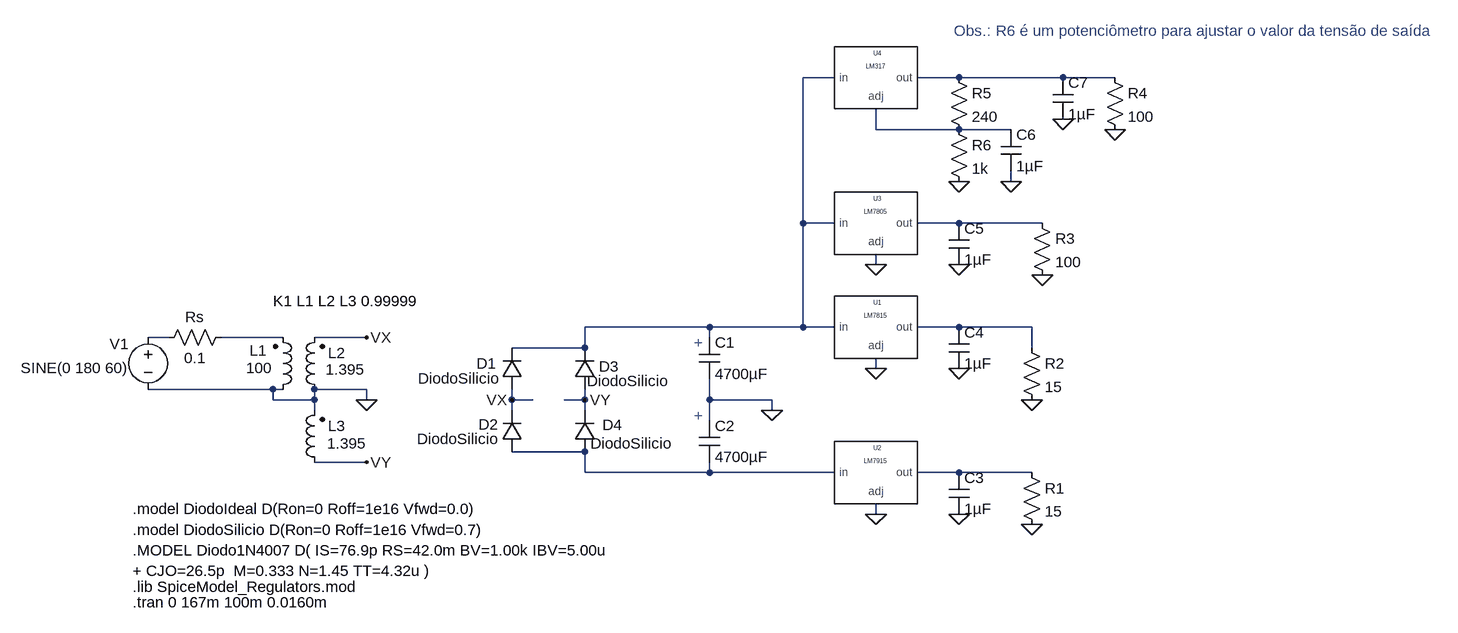
[diagram p0: schematic FonteLinear.Simula.LTSpice.asc]
FonteLinear.Simula.LTSpice.asc, the LTspice schematic file:
Version 4
SHEET 1 2300 1300
WIRE 1008 -16 960 -16
WIRE 1200 -16 1136 -16
WIRE 1360 -16 1200 -16
WIRE 1440 -16 1360 -16
WIRE 1072 64 1072 32
WIRE 1200 64 1072 64
WIRE 1280 64 1200 64
WIRE 1280 144 1280 128
WIRE 960 208 960 -16
WIRE 1008 208 960 208
WIRE 1200 208 1136 208
WIRE 1328 208 1200 208
WIRE 1072 272 1072 256
WIRE 816 368 624 368
WIRE 960 368 960 208
WIRE 960 368 816 368
WIRE 1008 368 960 368
WIRE 1200 368 1136 368
WIRE 1312 368 1200 368
WIRE -16 384 -48 384
WIRE 160 384 64 384
WIRE 288 384 208 384
WIRE 816 384 816 368
WIRE 624 400 624 368
WIRE 624 400 512 400
WIRE 1312 400 1312 368
WIRE 1072 432 1072 416
WIRE 144 464 -48 464
WIRE 160 464 144 464
WIRE 288 464 208 464
WIRE 144 480 144 464
WIRE 208 480 208 464
WIRE 208 480 144 480
WIRE 288 480 288 464
WIRE 512 480 512 464
WIRE 544 480 512 480
WIRE 624 480 624 464
WIRE 624 480 592 480
WIRE 816 480 816 448
WIRE 912 480 816 480
WIRE 208 496 208 480
WIRE 512 496 512 480
WIRE 624 496 624 480
WIRE 912 496 912 480
WIRE 816 512 816 480
WIRE 624 560 512 560
WIRE 288 576 208 576
WIRE 624 592 624 560
WIRE 816 592 816 576
WIRE 816 592 624 592
WIRE 1008 592 816 592
WIRE 1200 592 1136 592
WIRE 1312 592 1200 592
WIRE 1072 656 1072 640
FLAG 912 496 0
FLAG 288 384 VX
FLAG 512 480 VX
FLAG 624 480 VY
FLAG 288 576 VY
FLAG 288 480 0
FLAG 1072 432 0
FLAG 1312 480 0
FLAG 1072 656 0
FLAG 1328 288 0
FLAG 1072 272 0
FLAG 1200 144 0
FLAG 1440 64 0
FLAG 1312 672 0
FLAG 1200 272 0
FLAG 1200 432 0
FLAG 1200 656 0
FLAG 1360 48 0
FLAG 1280 144 0
SYMBOL voltage -48 368 R0
WINDOW 123 0 0 Left 2
WINDOW 39 -196 91 Left 2
WINDOW 0 -59 26 Left 2
WINDOW 3 -196 63 Left 2
SYMATTR InstName V1
SYMATTR Value SINE(0 180 60)
SYMBOL ind2 144 480 M180
WINDOW 0 -36 76 Left 2
WINDOW 3 -41 49 Left 2
SYMATTR InstName L1
SYMATTR Value 100
SYMATTR Type ind
SYMBOL ind2 224 480 R180
WINDOW 0 -32 72 Left 2
WINDOW 3 -62 47 Left 2
SYMATTR InstName L2
SYMATTR Value 1.395
SYMATTR Type ind
SYMATTR SpiceLine Rser=0
SYMBOL diode 528 464 R180
WINDOW 0 40 40 Left 2
WINDOW 3 35 17 Left 2
SYMATTR InstName D1
SYMATTR Value DiodoSilicio
SYMBOL diode 528 560 R180
WINDOW 0 37 42 Left 2
WINDOW 3 37 20 Left 2
SYMATTR InstName D2
SYMATTR Value DiodoSilicio
SYMBOL diode 640 464 R180
WINDOW 0 -37 35 Left 2
WINDOW 3 -113 13 Left 2
SYMATTR InstName D3
SYMATTR Value DiodoSilicio
SYMBOL diode 640 560 R180
WINDOW 0 -42 41 Left 2
WINDOW 3 -118 13 Left 2
SYMATTR InstName D4
SYMATTR Value DiodoSilicio
SYMBOL res 1296 384 R0
SYMATTR InstName R2
SYMATTR Value 15
SYMBOL res 80 368 R90
WINDOW 0 0 56 VBottom 2
WINDOW 3 32 56 VTop 2
SYMATTR InstName Rs
SYMATTR Value 0.1
SYMBOL cap 800 384 R0
SYMATTR InstName C1
SYMATTR Value 4700µF
SYMBOL ind2 224 592 R180
WINDOW 0 -32 72 Left 2
WINDOW 3 -64 45 Left 2
SYMATTR InstName L3
SYMATTR Value 1.395
SYMATTR Type ind
SYMATTR SpiceLine Rser=0
SYMBOL res 1296 576 R0
SYMATTR InstName R1
SYMATTR Value 15
SYMBOL cap 800 512 R0
SYMATTR InstName C2
SYMATTR Value 4700µF
SYMBOL SpiceSymbol_Regulators 1136 384 R0
SYMATTR InstName U1
SYMATTR SpiceModel LM7815
SYMBOL SpiceSymbol_Regulators 1136 608 R0
SYMATTR InstName U2
SYMATTR SpiceModel LM7915
SYMBOL SpiceSymbol_Regulators 1136 224 R0
SYMATTR InstName U3
SYMATTR SpiceModel LM7805
SYMBOL res 1312 192 R0
SYMATTR InstName R3
SYMATTR Value 100
SYMBOL SpiceSymbol_Regulators 1136 0 R0
SYMATTR InstName U4
SYMATTR SpiceModel LM317
SYMBOL res 1184 -32 R0
SYMATTR InstName R5
SYMATTR Value 240
SYMBOL res 1184 48 R0
SYMATTR InstName R6
SYMATTR Value 1k
SYMBOL res 1424 -32 R0
SYMATTR InstName R4
SYMATTR Value 100
SYMBOL cap 1184 592 R0
SYMATTR InstName C3
SYMATTR Value 1µF
SYMBOL cap 1184 368 R0
SYMATTR InstName C4
SYMATTR Value 1µF
SYMBOL cap 1184 208 R0
SYMATTR InstName C5
SYMATTR Value 1µF
SYMBOL cap 1264 64 R0
SYMATTR InstName C6
SYMATTR Value 1µF
SYMBOL cap 1344 -16 R0
SYMATTR InstName C7
SYMATTR Value 1µF
TEXT -72 792 Left 2 !.tran 0 167m 100m 0.0160m
TEXT -72 648 Left 2 !.model DiodoIdeal D(Ron=0 Roff=1e16 Vfwd=0.0)
TEXT -72 680 Left 2 !.model DiodoSilicio D(Ron=0 Roff=1e16 Vfwd=0.7)
TEXT 144 328 Left 2 !K1 L1 L2 L3 0.99999
TEXT -72 768 Left 2 !.lib SpiceModel_Regulators.mod
TEXT 792 392 Left 2 ;+
TEXT 792 504 Left 2 ;+
TEXT 1192 -88 Left 2 ;Obs.: R6 é um potenciômetro para ajustar o valor da tensão de saída
TEXT -72 712 Left 2 !.MODEL Diodo1N4007 D( IS=76.9p RS=42.0m BV=1.00k IBV=5.00u\n+ CJO=26.5p  M=0.333 N=1.45 TT=4.32u )

The netlist it stands for:
* FonteLinear.Simula.LTSpice.asc
V1 N006 0 SINE(0 180 60)
L1 0 N007 100
L2 0 VX 1.395 Rser=0
D1 VX N001 DiodoSilicio
D2 N008 VX DiodoSilicio
D3 VY N001 DiodoSilicio
D4 N008 VY DiodoSilicio
R2 N005 0 15
Rs N007 N006 0.1
C1 N001 0 4700µF
L3 VY 0 1.395 Rser=0
R1 N009 0 15
C2 0 N008 4700µF
XU1 N001 0 N005 LM7815  ; pins in adj out
XU2 N008 0 N009 LM7915  ; pins in adj out
XU3 N001 0 N004 LM7805  ; pins in adj out
R3 N004 0 100
XU4 N001 N003 N002 LM317  ; pins in adj out
R5 N002 N003 240
R6 N003 0 1k
R4 N002 0 100
C3 N009 0 1µF
C4 N005 0 1µF
C5 N004 0 1µF
C6 N003 0 1µF
C7 N002 0 1µF
.model D D
.lib standard.dio
.tran 0 167m 100m 0.0160m
.model DiodoIdeal D(Ron=0 Roff=1e16 Vfwd=0.0)
.model DiodoSilicio D(Ron=0 Roff=1e16 Vfwd=0.7)
K1 L1 L2 L3 0.99999
.lib SpiceModel_Regulators.mod
* +
* +
* Obs.: R6 é um potenciômetro para ajustar o valor da tensão de saída
.MODEL Diodo1N4007 D( IS=76.9p RS=42.0m BV=1.00k IBV=5.00u
+ CJO=26.5p  M=0.333 N=1.45 TT=4.32u )
.lib SpiceModel_Regulators.mod
.backanno
.end